# Altium project RX_Banda_Aerea_v5.PrjPcb
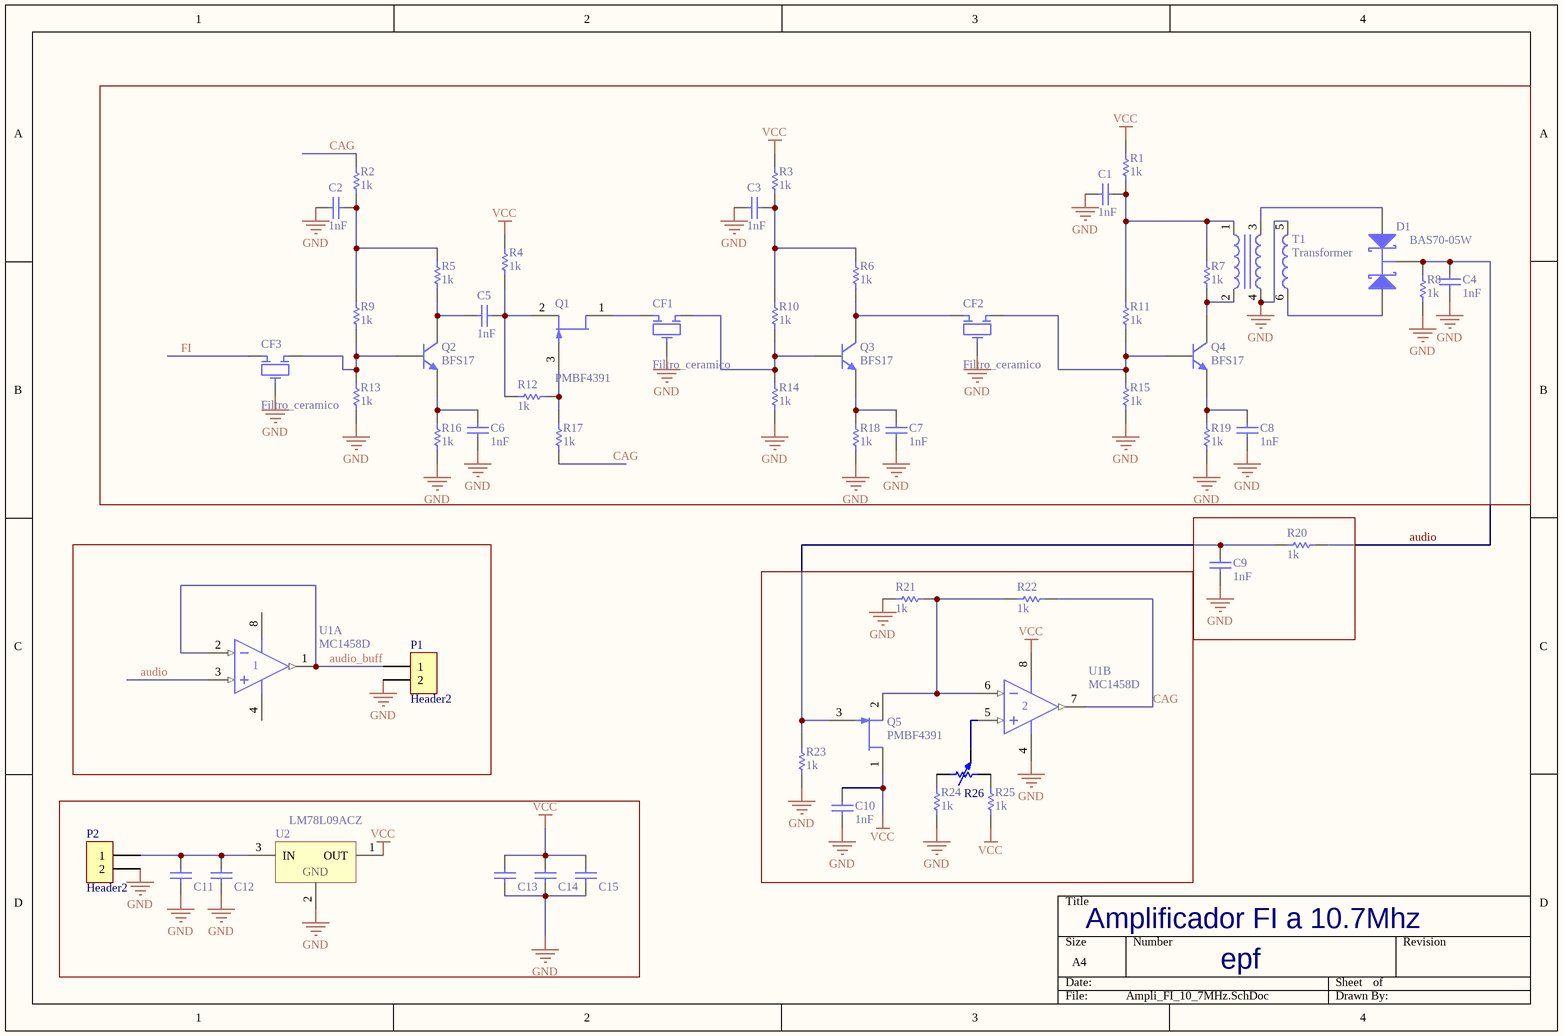
[diagram p0: Ampli_FI_10_7MHz.SchDoc]
2 sheets, 89 parts. Net scope: global (net labels, ports and power ports of the same name join across sheets).
Board file: RX_Banda_Aerea_v5.PcbDoc
Sheets:
  Ampli_FI_10_7MHz.SchDoc
  FiltroRF.SchDoc

## Sheet Ampli_FI_10_7MHz.SchDoc
size A4

### Parts
C1  value 1nF  [0805_CAP]  (hidden comment: Capacitor)
C2  value 1nF  [0805_CAP]  (hidden comment: Capacitor)
C3  value 1nF  [0805_CAP]  (hidden comment: Capacitor)
C4  value 1nF  [0805_CAP]  (hidden comment: Capacitor)
C5  value 1nF  [0805_CAP]  (hidden comment: Capacitor)
C6  value 1nF  [0805_CAP]  (hidden comment: Capacitor)
C7  value 1nF  [0805_CAP]  (hidden comment: Capacitor)
C8  value 1nF  [0805_CAP]  (hidden comment: Capacitor)
C9  value 1nF  [0805_CAP]  (hidden comment: Capacitor)
C10  value 1nF  [0805_CAP]  (hidden comment: Capacitor)
C11  Capacitor  [0805_CAP]  (value not drawn)
C12  Capacitor  [0805_CAP]  (value not drawn)
C13  Capacitor  [0805_CAP]  (value not drawn)
C14  Capacitor  [0805_CAP]  (value not drawn)
C15  Capacitor  [0805_CAP]  (value not drawn)
CF1  Filtro_ceramico  [Filter_10_7]
CF2  Filtro_ceramico  [Filter_10_7]
CF3  Filtro_ceramico  [Filter_10_7]
D1  BAS70-05W  [SOT323_N]
P1  Header2  [Header2Macho]
P2  Header2  [Header2Hembra]
Q1  PMBF4391  [SOT23]
Q2  BFS17  [SOT23]
Q3  BFS17  [SOT23]
Q4  BFS17  [SOT23]
Q5  PMBF4391  [SOT23]
R1  value 1k  [0805_RES]  (hidden comment: Resistor)
R2  value 1k  [0805_RES]  (hidden comment: Resistor)
R3  value 1k  [0805_RES]  (hidden comment: Resistor)
R4  value 1k  [0805_RES]  (hidden comment: Resistor)
R5  value 1k  [0805_RES]  (hidden comment: Resistor)
R6  value 1k  [0805_RES]  (hidden comment: Resistor)
R7  value 1k  [0805_RES]  (hidden comment: Resistor)
R8  value 1k  [0805_RES]  (hidden comment: Resistor)
R9  value 1k  [0805_RES]  (hidden comment: Resistor)
R10  value 1k  [0805_RES]  (hidden comment: Resistor)
R11  value 1k  [0805_RES]  (hidden comment: Resistor)
R12  value 1k  [0805_RES]  (hidden comment: Resistor)
R13  value 1k  [0805_RES]  (hidden comment: Resistor)
R14  value 1k  [0805_RES]  (hidden comment: Resistor)
R15  value 1k  [0805_RES]  (hidden comment: Resistor)
R16  value 1k  [0805_RES]  (hidden comment: Resistor)
R17  value 1k  [0805_RES]  (hidden comment: Resistor)
R18  value 1k  [0805_RES]  (hidden comment: Resistor)
R19  value 1k  [0805_RES]  (hidden comment: Resistor)
R20  value 1k  [0805_RES]  (hidden comment: Resistor)
R21  value 1k  [0805_RES]  (hidden comment: Resistor)
R22  value 1k  [0805_RES]  (hidden comment: Resistor)
R23  value 1k  [0805_RES]  (hidden comment: Resistor)
R24  value 1k  [0805_RES]  (hidden comment: Resistor)
R25  value 1k  [0805_RES]  (hidden comment: Resistor)
R26  Pot  [POT_SMD]  (value not drawn)
T1  Transformer  [NTH12_V_3Ind_2]
U1  MC1458D  [SO-8_2]  (parts A,B of 2)
U2  LM78L09ACZ  [TO92]

### Nets
GND: C1.1 C2.2 C3.2 C4.1 C6.2 C7.2 C8.1 C9.1 C10.1 C11.1 C12.1 C13.1 C14.1 C15.1 CF1.2 CF2.2 CF3.2 P1.2 P2.2 R8.2 R13.2 R14.2 R15.2 R16.2 R18.2 R19.2 R21.1 R23.2 R24.2 T1.4 T1.5 U1.4(V-) U2.2(GND)
VCC: C10.2 C13.2 C14.2 C15.2 Q5.1(D) R1.1 R3.1 R4.1 R25.1 U1.8(V+) U2.1(OUT)
audio: C4.2 D1.3(K) R8.1 R20.2 U1.3(IN+)
audio_buff: P1.1 U1.1(OUT) U1.2(IN-)
CAG: R2.1 R17.2 R22.2 U1.7(OUT)
FI: CF3.1
NetC1_2: C1.2 R1.2 R7.1 R11.1 T1.1
NetC2_1: C2.1 R2.2 R5.1 R9.1
NetC3_1: C3.1 R3.2 R6.1 R10.1
NetC5_1: C5.1 Q1.2(S) R4.2 R12.1
NetC5_2: C5.2 Q2.3(C) R5.2
NetC6_1: C6.1 Q2.2(E) R16.1
NetC7_1: C7.1 Q3.2(E) R18.1
NetC8_2: C8.2 Q4.2(E) R19.1
NetC9_2: C9.2 Q5.3(G) R20.1 R23.1
NetC11_2: C11.2 C12.2 P2.1 U2.3(IN)
NetCF1_1: CF1.1 Q1.1(D)
NetCF1_3: CF1.3 Q3.1(B) R10.2 R14.1
NetCF2_1: CF2.1 Q3.3(C) R6.2
NetCF2_3: CF2.3 Q4.1(B) R11.2 R15.1
NetCF3_3: CF3.3 Q2.1(B) R9.2 R13.1
NetD1_1: D1.1(A1) T1.3
NetD1_2: D1.2(A2) T1.6
NetQ1_3: Q1.3(G) R12.2 R17.1
NetQ4_3: Q4.3(C) R7.2 T1.2
NetQ5_2: Q5.2(S) R21.2 R22.1 U1.6(IN-)
NetR24_1: R24.1 R26.1
NetR25_2: R25.2 R26.2
NetR26_3: R26.3 U1.5(IN+)

### Notes on the sheet
- Amplificador FI a 10.7Mhz
- epf

### Library data of the parts
C1-C15 = Cap
CF1-CF3 = Filter_10_7
D1 = BAS70-05W: Schottky Barrier Double Diode; Published: 17-Sep-2003; LatestRevisionDate: 12-Dec-2006; LatestRevisionNote: IPC-7351 Footprint Added.; DatasheetVersion: 26-Mar-1999; PackageVersion: Apr-1999; PackageReference: SOT323; Publisher: Altium Limited; PackageDescription: 3-Pin SOT-323 Package 0.65 mm Pitch, 2.1 mm Lead Span; ComponentLink1Description: Manufacturer Link; ComponentLink1URL: http://www.semiconductors.philips.com/; ComponentLink2Description: Datasheet; ComponentLink2URL: http://www.semiconductors.philips.com/acrobat/datasheets/BAS70W_3.pdf
Q1 Q5 = PMBF4391: N-channel Silicon Junction Field-effect Transistor; Published: 17-Sep-2003; LatestRevisionDate: 12-Dec-2006; LatestRevisionNote: IPC-7351 Footprint Added.; DatasheetVersion: Apr-1995; PackageVersion: May-1999; PackageReference: SOT23; Publisher: Altium Limited; PackageDescription: 3-Pin SOT-23 Package 0.95 mm Pitch, 2.3 mm Lead Span; ComponentLink1Description: Manufacturer Link; ComponentLink1URL: http://www.semiconductors.philips.com/; ComponentLink2Description: Datasheet; ComponentLink2URL: http://www.semiconductors.philips.com/acrobat/datasheets/PMBF4391_4392_4393_CNV_2.pdf
Q2-Q4 = BFS17: NPN 1 GHz Wideband Transistor; Published: 17-Sep-2003; LatestRevisionDate: 12-Dec-2006; LatestRevisionNote: IPC-7351 Footprint Added.; DatasheetVersion: Sep-1995; PackageVersion: May-1999; PackageReference: SOT23; Publisher: Altium Limited; PackageDescription: 3-Pin SOT-23 Package 0.95 mm Pitch, 2.3 mm Lead Span; ComponentLink1Description: Manufacturer Link; ComponentLink1URL: http://www.semiconductors.philips.com/; ComponentLink2Description: Datasheet; ComponentLink2URL: http://www.semiconductors.philips.com/acrobat/datasheets/BFS17_2.pdf
R1-R25 = Res
T1 = Transformador3: Transformador 3 bobinas
U1 = MC1458D: Dual Operational Amplifier, Internally Compensated; Published: 17-Jul-2002; LatestRevisionDate: 13-Apr-2006; LatestRevisionNote: IPC-7351 Footprint Added.; DatasheetVersion: 1996; PackageVersion: 1996; PackageReference: 751-05; Publisher: Altium Limited; PackageDescription: 8-Pin Small Outline Integrated Circuit 1.27 mm Pitch; Code_JEDEC: MS-012-AA; Code_IPC: SOIC127P600-8; ComponentLink1Description: Manufacturer Link; ComponentLink1URL: http://www.onsemi.com/site/products/parametrics/0,4446,251,00.html
U2 = LM78L09ACZ: 3-Terminal Positive Regulators; Manufacturer: National Semiconductor; CompType: LDO IC; PackageTopMarking: NSXYTT*LM78L*09ACZ; Published: 4-Dec-2008; DatasheetVersion: Apr-2006; PackageVersion: revG, Sep-2000; PackageReference: Z03A; Publisher: Altium Limited; PackageDescription: TO-92, Molded, 3 Lead; PartNumber: LM78L09ACZ; RoHS: O; PinCount: 3; DigiKeyPartNumber: LM78L09ACZ-ND; Code_JEDEC: TO-226-AA; ComponentLink1Description: LM78L09 Datasheet; ComponentLink1URL: http://www.national.com/ds/LM/LM78L09.pdf; ComponentLink2Description: LM78L09 Web Page; ComponentLink2URL: http://www.national.com/pf/LM/LM78L09.html; ComponentLink3Description: Z03A Package Page; ComponentLink3URL: http://www.national.com/packaging/folders/z03a.html

## Sheet FiltroRF.SchDoc
size A4
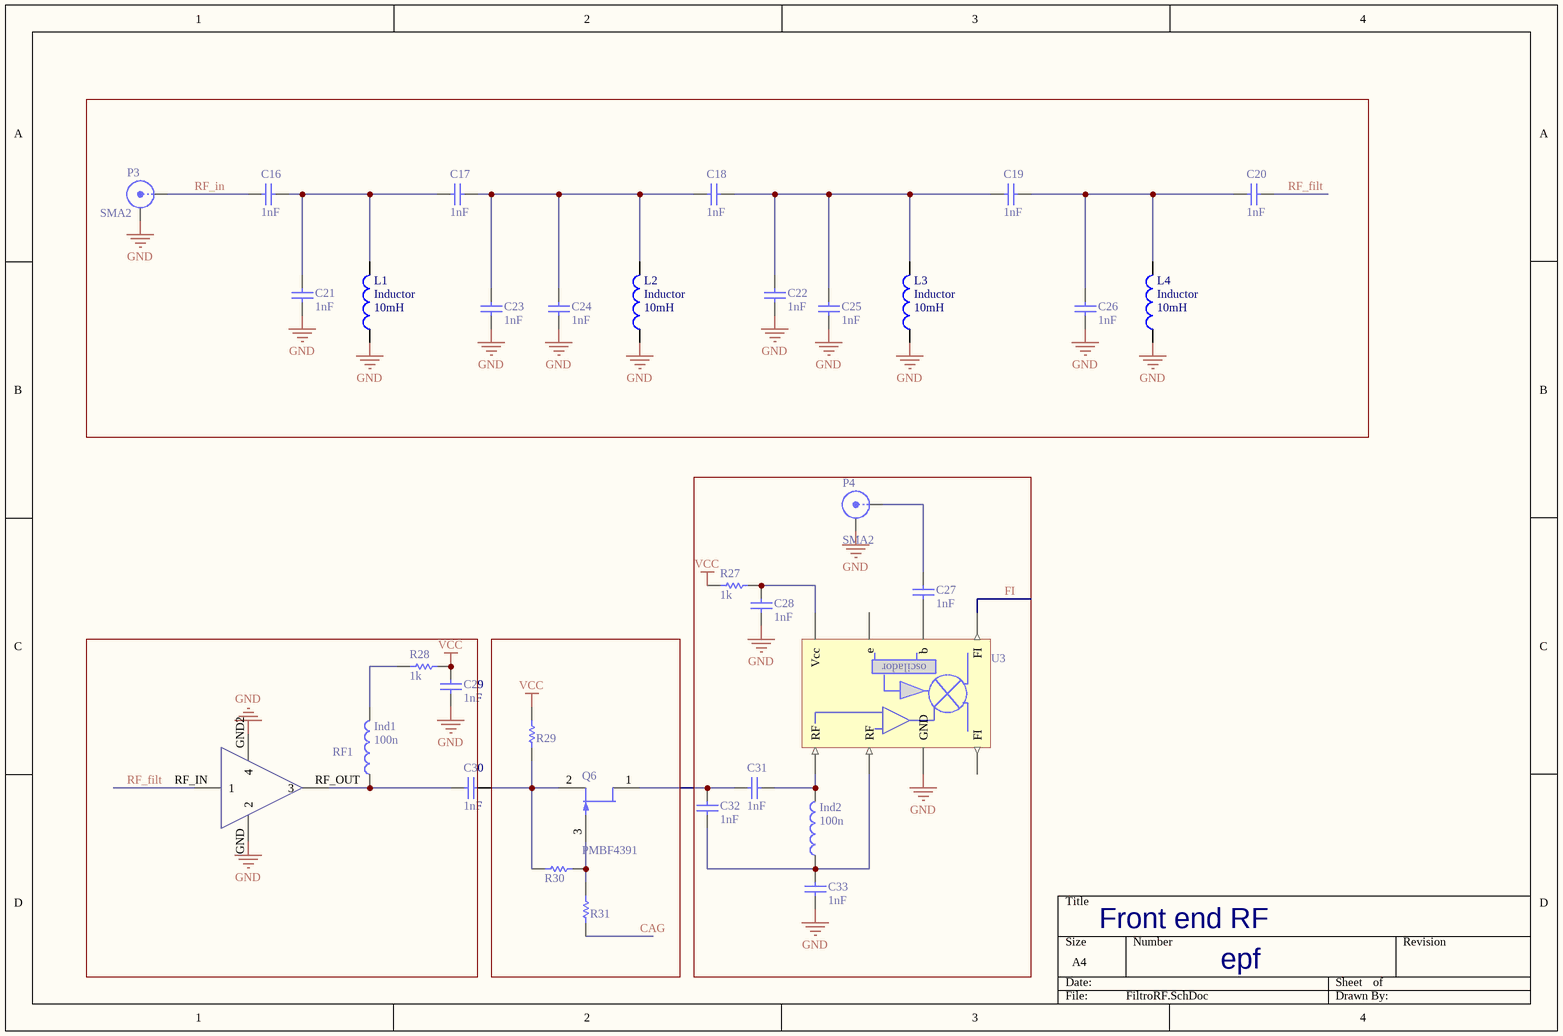
[diagram p1: FiltroRF.SchDoc]

### Parts
C16  value 1nF  [0805_CAP]  (hidden comment: Capacitor)
C17  value 1nF  [0805_CAP]  (hidden comment: Capacitor)
C18  value 1nF  [0805_CAP]  (hidden comment: Capacitor)
C19  value 1nF  [0805_CAP]  (hidden comment: Capacitor)
C20  value 1nF  [0805_CAP]  (hidden comment: Capacitor)
C21  value 1nF  [0805_CAP]  (hidden comment: Capacitor)
C22  value 1nF  [0805_CAP]  (hidden comment: Capacitor)
C23  value 1nF  [0805_CAP]  (hidden comment: Capacitor)
C24  value 1nF  [0805_CAP]  (hidden comment: Capacitor)
C25  value 1nF  [0805_CAP]  (hidden comment: Capacitor)
C26  value 1nF  [0805_CAP]  (hidden comment: Capacitor)
C27  value 1nF  [0805_CAP]  (hidden comment: Capacitor)
C28  value 1nF  [0805_CAP]  (hidden comment: Capacitor)
C29  value 1nF  [0805_CAP]  (hidden comment: Capacitor)
C30  value 1nF  [0805_CAP]  (hidden comment: Capacitor)
C31  value 1nF  [0805_CAP]  (hidden comment: Capacitor)
C32  value 1nF  [0805_CAP]  (hidden comment: Capacitor)
C33  value 1nF  [0805_CAP]  (hidden comment: Capacitor)
Ind1  Valor: 100n  [NTH12_2]  (hidden comment: Ind2)
Ind2  Valor: 100n  [Ind_3mm]  (hidden comment: Ind2)
L1  Inductor  value 10mH  [INDC3216AL]
L2  Inductor  value 10mH  [INDC3216AL]
L3  Inductor  value 10mH  [INDC3216AL]
L4  Inductor  value 10mH  [INDC3216AL]
P3  SMA2  [SMAL_Antena]
P4  SMA2  [SMAL2]
Q6  PMBF4391  [SOT23]
R27  value 1k  [0805_RES]  (hidden comment: Resistor)
R28  value 1k  [0805_RES]  (hidden comment: Resistor)
R29  Resistor  [0805_RES]  (value not drawn)
R30  Resistor  [0805_RES]  (value not drawn)
R31  Resistor  [0805_RES]  (value not drawn)
RF1  MAR-1SM  [WW107]  (value not drawn)
U3  SA602  [SO-8_2]  (value not drawn)

### Nets
GND: C21.2 C22.1 C23.1 C24.1 C25.1 C26.2 C28.1 C29.1 C33.2 L1.1 L2.1 L3.1 L4.1 P3.0(Y) P4.0(Y) RF1.GND(2) RF1.GND2(4) U3.3(GND)
VCC: C29.2 R27.1 R28.2 R29.1
CAG: R31.1
FI: U3.5(FI)
RF_filt: C20.1 RF1.RF_IN(1)
RF_in: C16.2 P3.1(X)
NetC16_1: C16.1 C17.2 C21.1 L1.2
NetC17_1: C17.1 C18.1 C23.2 C24.2 L2.2
NetC18_2: C18.2 C19.1 C22.2 C25.2 L3.2
NetC19_2: C19.2 C20.2 C26.1 L4.2
NetC27_1: C27.1 U3.6(b)
NetC27_2: C27.2 P4.1(X)
NetC28_2: C28.2 R27.2 U3.8(Vcc)
NetC30_1: C30.1 Q6.2(S) R29.2 R30.2
NetC30_2: C30.2 Ind1.1 RF1.RF_OUT(3)
NetC31_1: C31.1 Ind2.2 U3.1(RF)
NetC31_2: C31.2 C32.1 Q6.1(D)
NetC32_2: C32.2 C33.1 Ind2.1 U3.2(RF)
NetInd1_2: Ind1.2 R28.1
NetQ6_3: Q6.3(G) R30.1 R31.2

Not connected (* = marked no-connect by the designer): U3 4(FI) 7(e)

### Notes on the sheet
- Front end RF
- epf
- (in symbol SA602A) oscilador

### Library data of the parts
C16-C33 = Cap
L1-L4 = Inductor: Code_IEC: 1005; Published: 8-Jun-2000; LatestRevisionDate: 29-May-2009; LatestRevisionNote: IPC-7351 Footprint Added.; PackageReference: 0402-A; Publisher: Altium Limited; PackageDescription: Chip Inductor; Code_JEITA: 0402
P3 P4 = SMA2: BNC Elbow Connector; LatestRevisionDate: 17-Jul-2002; LatestRevisionNote: Re-released for DXP Platform.; Publisher: Altium Limited
Q6 = PMBF4391: as Q1 on sheet Ampli_FI_10_7MHz; Published: 17-Sep-2003; LatestRevisionDate: 12-Dec-2006; LatestRevisionNote: IPC-7351 Footprint Added.; DatasheetVersion: Apr-1995; PackageVersion: May-1999; PackageReference: SOT23; Publisher: Altium Limited; PackageDescription: 3-Pin SOT-23 Package 0.95 mm Pitch, 2.3 mm Lead Span; ComponentLink1Description: Manufacturer Link; ComponentLink1URL: http://www.semiconductors.philips.com/; ComponentLink2Description: Datasheet; ComponentLink2URL: http://www.semiconductors.philips.com/acrobat/datasheets/PMBF4391_4392_4393_CNV_2.pdf
R27-R31 = Res
RF1 = MAR-1SM: pin to pad: GND>2 GND2>4 RF_IN>1 RF_OUT>3
U3 = SA602A: Mezclador 500MHz

## Nets that join several sheets
GND: Ampli_FI_10_7MHz (33 pins), FiltroRF (18 pins)
VCC: Ampli_FI_10_7MHz (11 pins), FiltroRF (C29.2 R27.1 R28.2 R29.1)
CAG: Ampli_FI_10_7MHz (R2.1 R17.2 R22.2 U1.7), FiltroRF (R31.1)
FI: Ampli_FI_10_7MHz (CF3.1), FiltroRF (U3.5)